# EAGLE design rcserial60b50ttl (EAGLE 9.6.2)
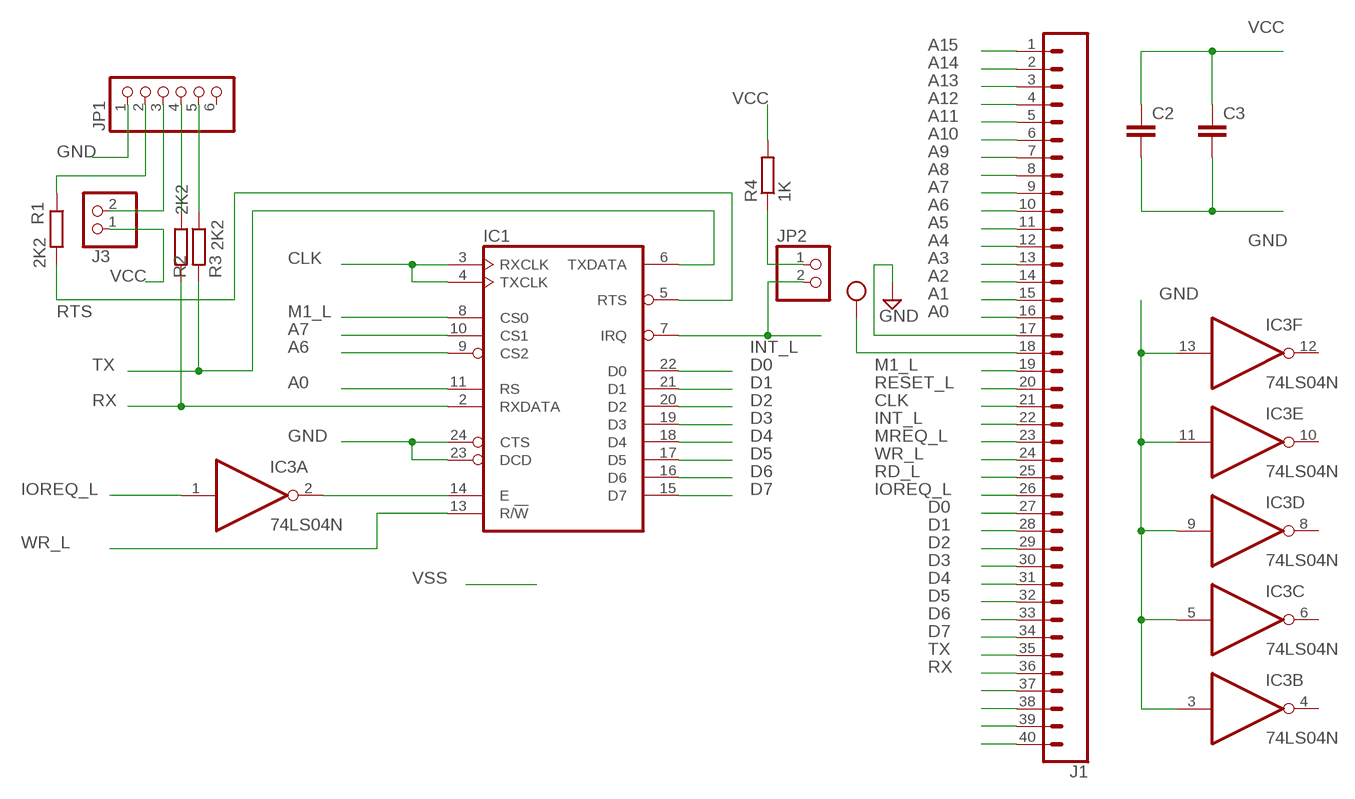
[diagram p0: schematic, sheet 1]

## Parts
C2  C-EU050-025X075  [C050-025X075]
C3  C-EU050-025X075  [C050-025X075]
IC1  6850  [DIL24]
IC3  74LS04N  [DIL14]
J1  CONN_40OFFSET  [1X40_OFFSET]
J3  PINHD-1X2  [1X02]
JP1  PINHD-1X6  [1X06]
JP2  PINHD-1X2  [1X02]
R1  2K2  R-EU_0204/7  [0204/7]
R2  2K2  R-EU_0204/7  [0204/7]
R3  2K2  R-EU_0204/7  [0204/7]
R4  1K  R-EU_0204/7  [0204/7]

## Nets
A0: IC1.11(RS) J1.16
A1: J1.15
A2: J1.14
A3: J1.13
A4: J1.12
A5: J1.11
A6: IC1.9(CS2) J1.10
A7: IC1.10(CS1) J1.9
A8: J1.8
A9: J1.7
A10: J1.6
A11: J1.5
A12: J1.4
A13: J1.3
A14: J1.2
A15: J1.1
CLK: IC1.3(RXCLK) IC1.4(TXCLK) J1.21
D0: IC1.22(D0) J1.27
D1: IC1.21(D1) J1.28
D2: IC1.20(D2) J1.29
D3: IC1.19(D3) J1.30
D4: IC1.18(D4) J1.31
D5: IC1.17(D5) J1.32
D6: IC1.16(D6) J1.33
D7: IC1.15(D7) J1.34
GND: C2.2 C3.2 IC1.23(DCD) IC1.24(CTS) IC3.3(B:I) IC3.5(C:I) IC3.9(D:I) IC3.11(E:I) IC3.13(F:I) J1.17 JP1.1
INT_L: IC1.7(IRQ) J1.22 JP2.2
IOREQ_L: IC3.1(A:I) J1.26
M1_L: IC1.8(CS0) J1.19
MREQ_L: J1.23
N$1: J1.37
N$2: J1.38
N$3: J1.39
N$4: IC1.14(E) IC3.2(A:O)
N$5: JP1.2 R1.1
N$6: J3.2 JP1.3
N$7: JP1.4 R2.1
N$8: JP1.5 R3.1
N$9: JP2.1 R4.1
N$13: J1.40
RD_L: J1.25
RESET_L: J1.20
RTS: IC1.5(RTS) R1.2
RX: IC1.2(RXDATA) J1.36 R2.2
TX: IC1.6(TXDATA) J1.35 R3.2
VCC: C2.1 C3.1 J1.18 J3.1 R4.2
WR_L: IC1.13(R/!W) J1.24
Unconnected: IC3.4(B:O) IC3.6(C:O) IC3.8(D:O) IC3.10(E:O) IC3.12(F:O) JP1.6

## Power pins joined to a net without a drawn wire
GND: IC3.7(P:GND)
VCC: IC1.12(VCC) IC3.14(P:VCC)
VSS: IC1.1(VSS)

## Library data of the parts
C2 C3 = LabE:C-EU: CAPACITOR, European symbol; SPICEPREFIX: C
IC1 = micro-motorola:6850: MICROCONTROLLER/MEMORY DEVICE; MF: NTE ELECTRONICS; MPN: NTE6850; OC_FARNELL: 4899775; OC_NEWARK: 31C2457
IC3 = 74xx-eu:74*04: Hex INVERTER
J1 = SparkFun-Connectors:CONN_40: Multi connection point. Often used as Generic Header-pin footprint for 0.1 inch spaced/style header connections On any of the 0.1 inch spaced packages, you can populate with these: Break Away Headers - Straight <https://www.sparkfun.com/products/116> (PRT-00116) Break Away Male Headers - Right Angle <https://www.sparkfun.com/products/553> (PRT-00553) Female Headers <https://www.sparkfun.com/products/115> (PRT-00115) Break Away Headers - Machine Pin <https://www.sparkfun.com/products/117> (PRT-00117) Break Away Female Headers - Swiss Machine Pin <https://www.sparkfun.com/products/743> (PRT-00743) For SCREWTERMINALS and SPRING TERMINALS visit here: Screw Terimnals on SparkFun.com <https://www.sparkfun.com/search/results?term=Screw+Terminals> (5mm/3.5mm/2.54mm spacing) This device is also useful as a general connection point to wire up your design to another part of your project. Our various solder wires solder well into these plated through hole pads. Hook-Up Wire - Assortment (Stranded, 22 AWG) <https://www.sparkfun.com/products/11375> (PRT-11375) Hook-Up Wire - Assortment (Solid Core, 22 AWG) <https://www.sparkfun.com/products/11367> (PRT-11367) View the entire wire category on our website here <https://www.sparkfun.com/categories/141> Special notes: Molex polarized connector foot print use with SKU : PRT-08231 with associated crimp pins and housings. 1MM SMD Version SKU: PRT-10208 NOTES ON THE VARIANTS LOCK and LOCK_LONGPADS... This footprint was designed to help hold the alignment of a through-hole component (i.e. 6-pin header) while soldering it into place. You may notice that each hole has been shifted either up or down by 0.005 of an inch from it's more standard position (which is a perfectly straight line). This slight alteration caused the pins (the squares in the middle) to touch the edges of the holes. Because they are alternating, it causes a "brace" to hold the component in place. 0.005 has proven to be the perfect amount of "off-center" position when using our standard breakaway headers. Although looks a little odd when you look at the bare footprint, once you have a header in there, the alteration is very hard to notice. Also,if you push a header all the way into place, it is covered up entirely on the bottom side.
J3 JP2 = pinhead:PINHD-1X2: PIN HEADER
JP1 = pinhead:PINHD-1X6: PIN HEADER
R1-R4 = rcl:R-EU_: RESISTOR, European symbol; SPICEPREFIX: R

## Board
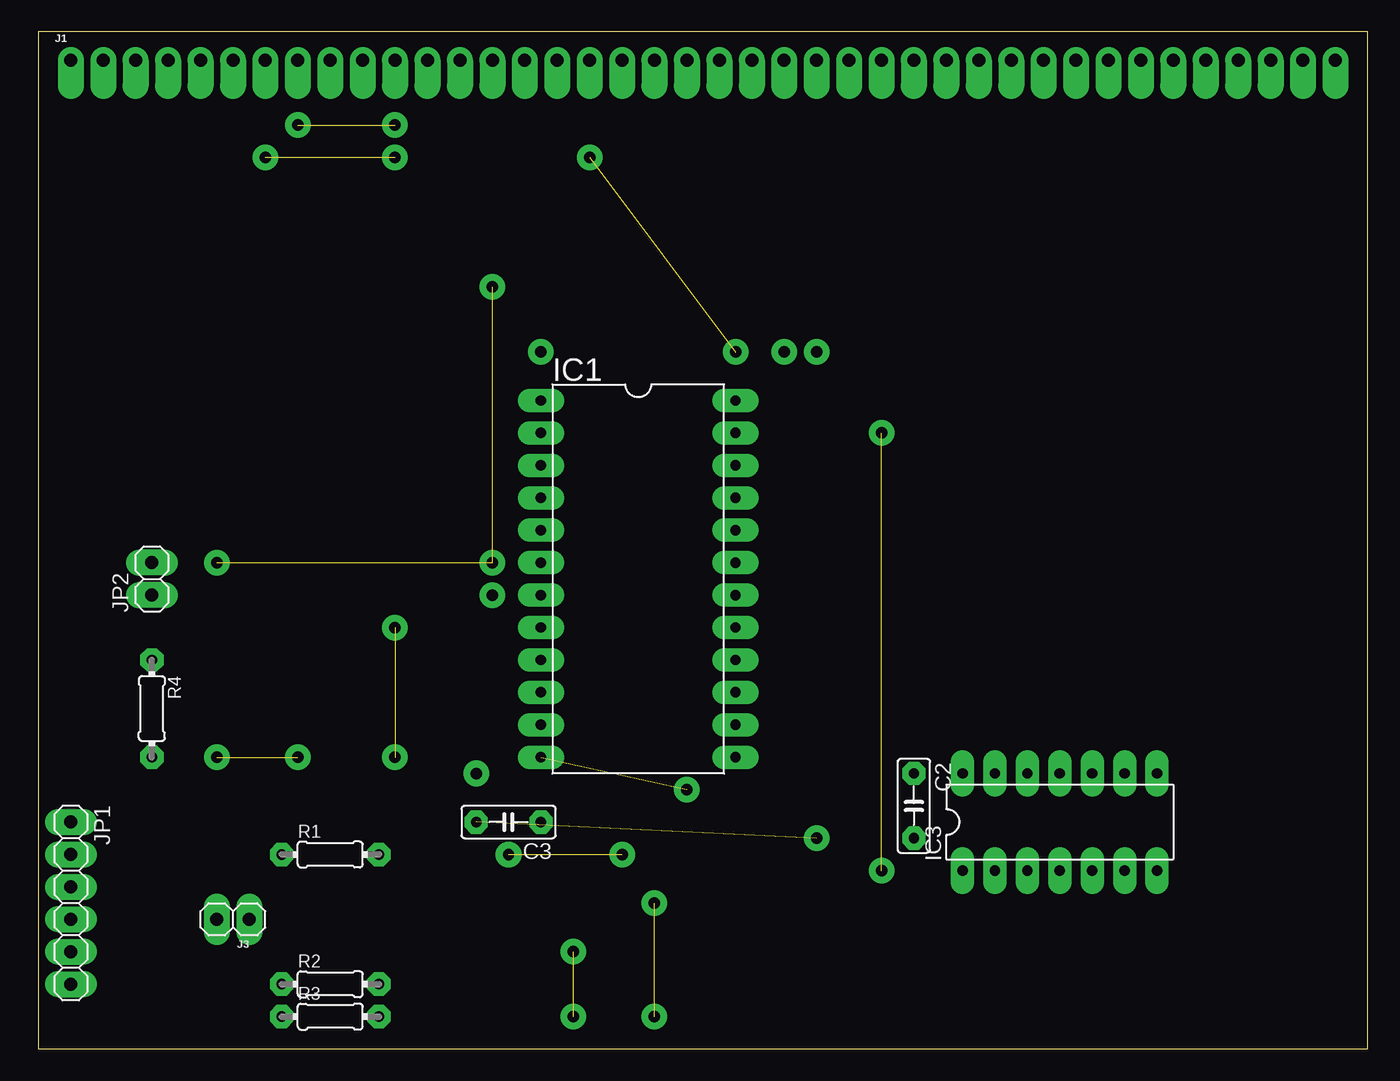
[diagram p1: board, top side]
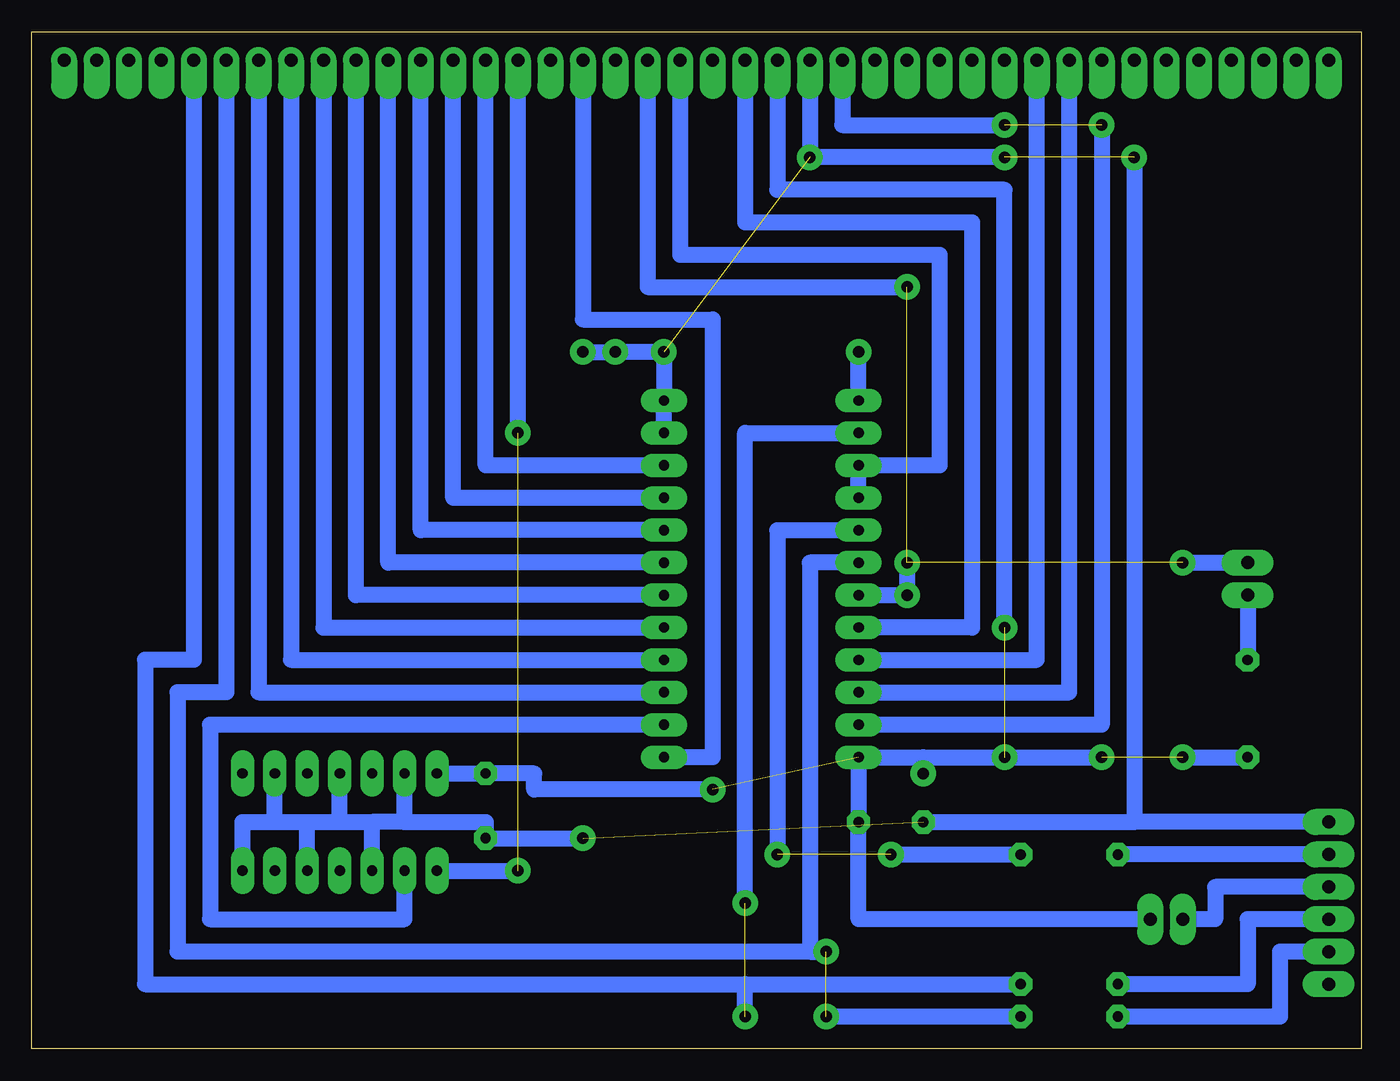
[diagram p2: board, bottom side, seen from below]

Size 104.12 x 79.68 mm. Coordinates in mm from the lower left corner, seen from the top.
Outline: 0,0 104.12,0 104.12,79.68 0,79.68 0,0
Copper layers (1*16): Top 0.035mm / dielectric 1.5mm / Bottom 0.035mm
Design rules "LabE": minimum track width 50mil, minimum drill 0.8mm, track to track 16mil, track to pad 16mil, pad to pad 16mil, via to via 16mil, smd to smd 16mil, copper to edge 0mil, drill to drill 16mil, minimum pad ring 20mil, minimum via ring 20mil, stop-mask expansion 4mil, vias tented up to drill 0mil, thermal gap 10mil

### Footprints (pad centres in the part's own frame; a part is rotated, then mirrored left to right if it is on the bottom)
C050-025X075 = drill 0.813 octagon: 1 -2.54,0; 2 2.54,0
DIL24 = drill 0.813 long: 1 -13.97,-7.62; 2 -11.43,-7.62; 3 -8.89,-7.62; 4 -6.35,-7.62; 5 -3.81,-7.62; 6 -1.27,-7.62; 7 1.27,-7.62; 8 3.81,-7.62; 9 6.35,-7.62; 10 8.89,-7.62; 11 11.43,-7.62; 12 13.97,-7.62; 13 13.97,7.62; 14 11.43,7.62; 15 8.89,7.62; 16 6.35,7.62; 17 3.81,7.62; 18 1.27,7.62; 19 -1.27,7.62; 20 -3.81,7.62; 21 -6.35,7.62; 22 -8.89,7.62; 23 -11.43,7.62; 24 -13.97,7.62
DIL14 = drill 0.813 long: 1 -7.62,-3.81; 2 -5.08,-3.81; 3 -2.54,-3.81; 4 0,-3.81; 5 2.54,-3.81; 6 5.08,-3.81; 7 7.62,-3.81; 8 7.62,3.81; 9 5.08,3.81; 10 2.54,3.81; 11 0,3.81; 12 -2.54,3.81; 13 -5.08,3.81; 14 -7.62,3.81
1X40_OFFSET = drill 1.016 pad 1.88 offset: 1 0,0; 2 2.54,0; 3 5.08,0; 4 7.62,0; 5 10.16,0; 6 12.7,0; 7 15.24,0; 8 17.78,0; 9 20.32,0; 10 22.86,0; 11 25.4,0; 12 27.94,0; 13 30.48,0; 14 33.02,0; 15 35.56,0; 16 38.1,0; 17 40.64,0; 18 43.18,0; 19 45.72,0; 20 48.26,0; 21 50.8,0; 22 53.34,0; 23 55.88,0; 24 58.42,0; 25 60.96,0; 26 63.5,0; 27 66.04,0; 28 68.58,0; 29 71.12,0; 30 73.66,0; 31 76.2,0; 32 78.74,0; 33 81.28,0; 34 83.82,0; 35 86.36,0; 36 88.9,0; 37 91.44,0; 38 93.98,0; 39 96.52,0; 40 99.06,0
1X02 = drill 1.016 long: 1 -1.27,0; 2 1.27,0
1X06 = drill 1.016 long: 1 -6.35,0; 2 -3.81,0; 3 -1.27,0; 4 1.27,0; 5 3.81,0; 6 6.35,0
0204/7 = drill 0.813 octagon: 1 -3.81,0; 2 3.81,0

### Placement (x,y rotation side)
C2  68.58,19.05 270 top
C3  36.83,17.78 180 top
IC1  46.99,36.83 270 top
IC3  80.01,17.78 0 top
J1  2.54,77.47 0 top
J3  15.24,10.16 180 top
JP1  2.54,11.43 270 top
JP2  8.89,36.83 90 top
R1  22.86,15.24 0 top
R2  22.86,5.08 0 top
R3  22.86,2.54 0 top
R4  8.89,26.67 270 top

### Tracks (layer width: path | path; a pad name or v marks a point on that pad's centre or on a via)
A0  (via drill 0.9 pad 2)  (1 unrouted)
  Bottom 1.27: IC1.11 20.32,25.4 v20.32,72.39 | J1.16 40.64,72.39 v27.94,72.39
A6
  Bottom 1.27: IC1.9 25.4,30.48 J1.10
A7
  Bottom 1.27: IC1.10 22.86,27.94 J1.9
CLK
  Bottom 1.27: J1.21 53.34,62.23 33.02,62.23 33.02,45.72 IC1.3 IC1.4
D0
  Bottom 1.27: IC1.22 68.58,45.72 J1.27
D1
  Bottom 1.27: IC1.21 71.12,43.18 J1.28
D2
  Bottom 1.27: IC1.20 73.66,40.64 J1.29
D3
  Bottom 1.27: IC1.19 76.2,38.1 J1.30
D4
  Bottom 1.27: IC1.18 78.74,35.56 J1.31
D5
  Bottom 1.27: J1.32 81.28,33.02 IC1.17
D6
  Bottom 1.27: J1.33 83.82,30.48 IC1.16
D7
  Bottom 1.27: J1.34 86.36,27.94 IC1.15
GND  (via drill 0.9 pad 2)  (3 unrouted)
  Bottom 1.27: IC1.23 IC1.24 v54.61,54.61 v58.42,54.61 v60.96,54.61 | IC3.7 87.63,17.78 85.09,17.78 | 85.09,17.78 IC3.9 | 85.09,17.78 82.55,17.78 | 82.55,17.78 80.01,17.78 | 80.01,17.78 IC3.11 | 80.01,17.78 77.47,17.78 | 74.93,17.78 IC3.13 | 74.93,17.78 68.58,17.78 C2.2 v60.96,16.51 | 74.93,17.78 77.47,17.78 | IC3.3 77.47,17.78 | IC3.5 82.55,17.78 | v27.94,69.85 v43.18,69.85 J1.17 | JP1.1 17.78,17.78 | v17.78,69.85 17.78,17.78 | C3.2 17.78,17.78
INT_L  (via drill 0.9 pad 2)  (2 unrouted)
  Bottom 1.27: J1.22 55.88,59.69 v35.56,59.69 | IC1.7 v35.56,35.56 v35.56,38.1 | v13.97,38.1 JP2.2
IOREQ_L  (via drill 0.9 pad 2)  (1 unrouted)
  Bottom 1.27: v66.04,48.26 J1.26 | IC3.1 v66.04,13.97
M1_L
  Bottom 1.27: J1.19 48.26,64.77 30.48,64.77 30.48,33.02 IC1.8
N$4
  Bottom 1.27: IC1.14 90.17,25.4 90.17,10.16 74.93,10.16 IC3.2
N$5
  Bottom 1.27: JP1.2 R1.1
N$6
  Bottom 1.27: J3.2 11.43,10.16 11.43,12.7 JP1.3
N$7
  Bottom 1.27: JP1.4 8.89,10.16 8.89,5.08 R2.1
N$8
  Bottom 1.27: JP1.5 6.35,7.62 6.35,2.54 R3.1
N$9
  Bottom 1.27: JP2.1 R4.1
RTS  (via drill 0.9 pad 2)  (1 unrouted)
  Bottom 1.27: IC1.5 45.72,40.64 v45.72,15.24 | v36.83,15.24 R1.2
RX  (via drill 0.9 pad 2)  (1 unrouted)
  Bottom 1.27: J1.36 91.44,30.48 95.25,30.48 95.25,5.08 48.26,5.08 | 48.26,5.08 R2.2 | IC1.2 48.26,48.26 v48.26,11.43 | v48.26,2.54 48.26,5.08
TX  (via drill 0.9 pad 2)  (1 unrouted)
  Bottom 1.27: J1.35 88.9,27.94 92.71,27.94 92.71,7.62 43.18,7.62 | IC1.6 43.18,38.1 43.18,7.62 | 43.18,7.62 v41.91,7.62 | R3.2 v41.91,2.54
VCC  (via drill 0.9 pad 2)  (3 unrouted)
  Bottom 1.27: J1.18 45.72,67.31 27.94,67.31 v27.94,33.02 | J3.1 39.37,10.16 C3.1 IC1.12 34.29,22.86 | IC3.14 C2.1 64.77,21.59 64.77,20.32 v50.8,20.32 | 34.29,22.86 v27.94,22.86 v20.32,22.86 | v34.29,21.59 34.29,22.86 | v13.97,22.86 R4.2
VSS  (via drill 0.9 pad 2)
  Bottom 1.27: IC1.1 v39.37,54.61
WR_L
  Bottom 1.27: IC1.13 50.8,22.86 50.8,57.15 60.96,57.15 J1.24